# Altium schematic sheet Mechanical.SchDoc: Mechanical
size A; Organization: UCLA High Energy Physics; DocumentNumber: 12; Revision: 2.0; SheetNumber: 12; SheetTotal: 12; CurrentDate: 8/7/2018; ModifiedDate: 2/7/2018; ProjectName: ALCT S-6 Optical Mezzanine
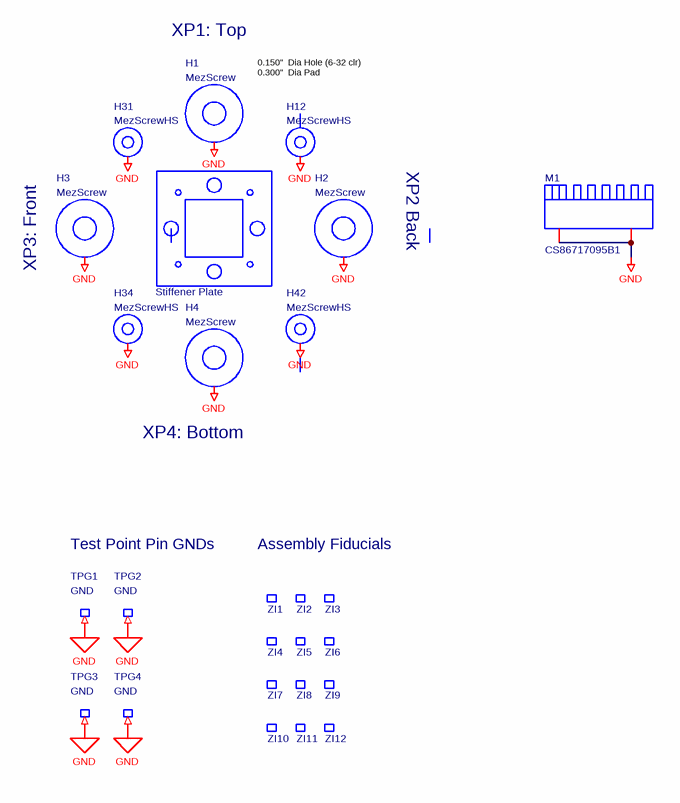
[diagram p0: Mechanical.SchDoc]

## Parts
H1  MezScrew  [MC_S6/TH/SCREW_BASE]  (no BOM)
H2  MezScrew  [MC_S6/TH/SCREW_BASE]  (no BOM)
H3  MezScrew  [MC_S6/TH/SCREW_BASE]  (no BOM)
H4  MezScrew  [MC_S6/TH/SCREW_BASE]  (no BOM)
H12  MezScrewHS  [MC_S6/TH/SCREW_PLATE]  (no BOM)
H31  MezScrewHS  [MC_S6/TH/SCREW_PLATE]  (no BOM)
H34  MezScrewHS  [MC_S6/TH/SCREW_PLATE]  (no BOM)
H42  MezScrewHS  [MC_S6/TH/SCREW_PLATE]  (no BOM)
M1  CS86717095B1  [CS86717095B1]  (no BOM)
SP1  Stiffener Plate  [MC_S6/SPLATE]  (no BOM)
TPG1  GND  [MC_S6/TH/TPGND]  (no BOM)
TPG2  GND  [MC_S6/TH/TPGND]  (no BOM)
TPG3  GND  [MC_S6/TH/TPGND]  (no BOM)
TPG4  GND  [MC_S6/TH/TPGND]  (no BOM)
ZI1  Fiducial Dot  [MC_S6/SM/FIDUCIAL_DOT]  (value not drawn)  (no BOM)
ZI2  Fiducial Dot  [MC_S6/SM/FIDUCIAL_DOT]  (value not drawn)  (no BOM)
ZI3  Fiducial Dot  [MC_S6/SM/FIDUCIAL_DOT]  (value not drawn)  (no BOM)
ZI4  Fiducial Dot  [MC_S6/SM/FIDUCIAL_DOT]  (value not drawn)  (no BOM)
ZI5  Fiducial Dot  [MC_S6/SM/FIDUCIAL_DOT]  (value not drawn)  (no BOM)
ZI6  Fiducial Dot  [MC_S6/SM/FIDUCIAL_DOT]  (value not drawn)  (no BOM)
ZI7  Fiducial Dot  [MC_S6/SM/FIDUCIAL_DOT]  (value not drawn)  (no BOM)
ZI8  Fiducial Dot  [MC_S6/SM/FIDUCIAL_DOT]  (value not drawn)  (no BOM)
ZI9  Fiducial Dot  [MC_S6/SM/FIDUCIAL_DOT]  (value not drawn)  (no BOM)
ZI10  Fiducial Dot  [MC_S6/SM/FIDUCIAL_DOT]  (value not drawn)  (no BOM)
ZI11  Fiducial Dot  [MC_S6/SM/FIDUCIAL_DOT]  (value not drawn)  (no BOM)
ZI12  Fiducial Dot  [MC_S6/SM/FIDUCIAL_DOT]  (value not drawn)  (no BOM)

## Nets
GND: H1.1(GND) H2.1(GND) H3.1(GND) H4.1(GND) H12.1(GND) H31.1(GND) H34.1(GND) H42.1(GND) M1.1 M1.2 TPG1.1(In) TPG2.1(In) TPG3.1(In) TPG4.1(In)

Not connected (* = marked no-connect by the designer): ZI1 1(NC); ZI2 1(NC); ZI3 1(NC); ZI4 1(NC); ZI5 1(NC); ZI6 1(NC); ZI7 1(NC); ZI8 1(NC); ZI9 1(NC); ZI10 1(NC); ZI11 1(NC); ZI12 1(NC)

## Notes on the sheet
- XP1: Top
- 0.150"  Dia Hole (6-32 clr)
  0.300"  Dia Pad
- XP2 Back
- (near H3) XP3: Front
- (near H4) XP4: Bottom
- Test Point Pin GNDs
- Assembly Fiducials
- Date:
- Rev:
- of
- Sheet

## Library data of the parts
H1-H4 = MezScrew: COMPSIDE: TOP; COMPGROUP: 0; mfgr_id: 92949A146; mfgr: McMaster; mfgr_foot: 6-32 ButtonSkt; COMPROT: 0
H12 H31 H34 H42 = MezScrewHS: mfgr_foot: 6-32 ButtonSkt; mfgr: McMaster; mfgr_id: 92949A146; COMPROT: 0; COMPSIDE: TOP; COMPGROUP: 0
M1 = CS86717095B1: Heatsink 17 x 17 x 9.5mm
SP1 = SPlate_MC_S6
TPG1-TPG4 = TPGND: mfgr_id: 2341; mfgr: Mill-Max; mfgr_foot: Turret; silk: What; COMPROT: 0; COMPSIDE: TOP; Package: 90; COMPGROUP: 0
ZI1-ZI12 = Fiducial_dot: mfgr_foot: FID; mfgr: Layout; COMPROT: 0; COMPSIDE: TOP; mfgr_id: FID; Package: 90; COMPGROUP: 0